# EAGLE design TUR8535 (EAGLE 5.01)
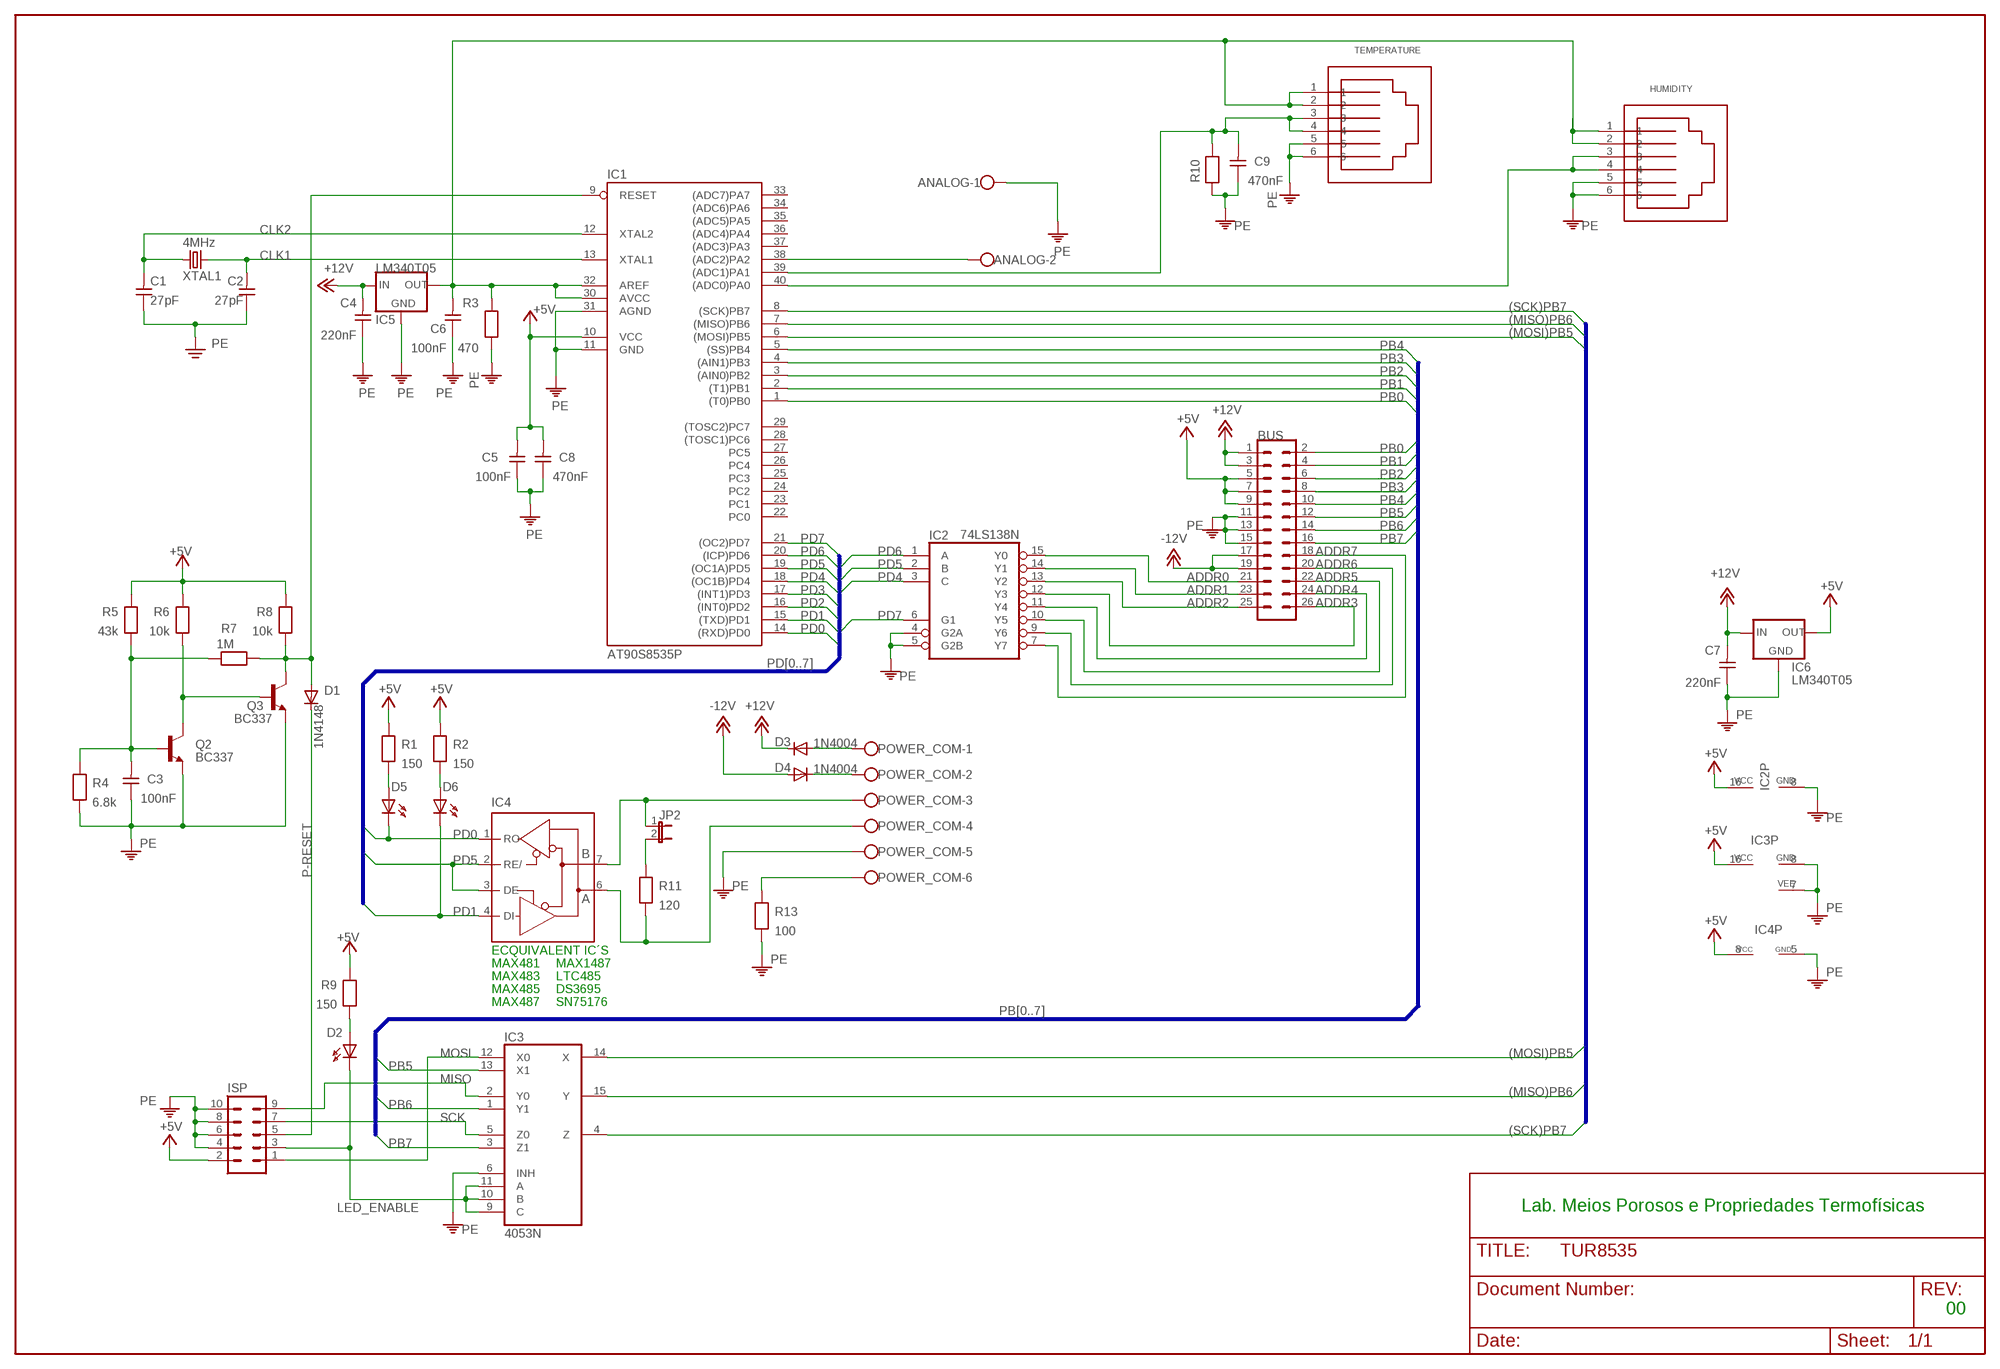
[diagram p0: schematic, sheet 1]

## Parts
ANALOG  AK500/2  [AK500/2]
BUS  ML26  [ML26]
C1  27pF  CAPNP-5  [C-5]
C2  27pF  CAPNP-5  [C-5]
C3  100nF  CAPNP-5  [C-5]
C4  220nF  CAPNP-5  [C-5]
C5  100nF  CAPNP-5  [C-5]
C6  100nF  CAPNP-5  [C-5]
C7  220nF  CAPNP-5  [C-5]
C8  470nF  CAPNP-5  [C-5]
C9  470nF  CAPNP-5  [C-5]
D1  1N4148  [DO35-10]
D2  LED5MM  [LED5MM]
D3  1N4004  [DO41-10]
D4  1N4004  [DO41-10]
D5  LED3MM  [LED3MM]
D6  LED3MM  [LED3MM]
HUMIDITY  RJ11V  [RJ11V]
IC1  AT90S8535P  [DIL40]
IC2  74LS138N  [DIL16]
IC3  4053N  [DIL16]
IC4  MAX481CPA  [DIL08]
IC5  LM340T05  78XXL  [78XXL]
IC6  LM340T05  78XXL  [78XXL]
ISP  ML10  [ML10]
JP2  JP1E  [JP1]
POWER_COM  AK500/6  [AK500/6]
Q2  BC337  [TO92]
Q3  BC337  [TO92]
R1  150  RESEU-10  [R-10]
R2  150  RESEU-10  [R-10]
R3  470  RESEU-10  [R-10]
R4  6.8k  RESEU-10  [R-10]
R5  43k  RESEU-10  [R-10]
R6  10k  RESEU-10  [R-10]
R7  1M  RESEU-10  [R-10]
R8  10k  RESEU-10  [R-10]
R9  150  RESEU-10  [R-10]
R10  RESEU-10  [R-10]
R11  120  RESEU-10  [R-10]
R13  100  RESEU-10  [R-10]
TEMPERATURE  RJ11V  [RJ11V]
XTAL1  4MHz  CRYTALHC18U-V  [HC18U-V]

## Nets
(MISO)PB6: IC1.7((MISO)PB6) IC3.15(Y)
(MOSI)PB5: IC1.6((MOSI)PB5) IC3.14(X)
(SCK)PB7: IC1.8((SCK)PB7) IC3.4(Z)
+5V: BUS.5 BUS.7 BUS.9 C5.2 C8.2 IC1.10(VCC) IC2.16(VCC) IC3.16(VCC) IC4.8(VCC) IC6.OUT ISP.2 R1.2 R2.2 R5.2 R6.2 R8.2 R9.2
+12V: BUS.1 BUS.3 C4.2 C7.2 D3.C IC5.IN IC6.IN
-12V: BUS.17 BUS.19 D4.A
A: IC4.6(A) POWER_COM.4 R11.1
ADC0: HUMIDITY.3 HUMIDITY.4 IC1.40((ADC0)PA0)
ADC1: C9.2 IC1.39((ADC1)PA1) R10.2 TEMPERATURE.3 TEMPERATURE.4
ADC2: ANALOG.2 IC1.38((ADC2)PA2)
ADDR0: BUS.21 IC2.15(Y0)
ADDR1: BUS.23 IC2.14(Y1)
ADDR2: BUS.25 IC2.13(Y2)
ADDR3: BUS.26 IC2.12(Y3)
ADDR4: BUS.24 IC2.11(Y4)
ADDR5: BUS.22 IC2.10(Y5)
ADDR6: BUS.20 IC2.9(Y6)
ADDR7: BUS.18 IC2.7(Y7)
AREF: C6.2 HUMIDITY.1 HUMIDITY.2 IC1.30(AVCC) IC1.32(AREF) IC5.OUT R3.2 TEMPERATURE.1 TEMPERATURE.2
B: IC4.7(B) JP2.1 POWER_COM.3
CLK1: C2.2 IC1.13(XTAL1) XTAL1.2
CLK2: C1.2 IC1.12(XTAL2) XTAL1.1
LED_ENABLE: D2.K(C) IC3.9(C) IC3.10(B) IC3.11(A) ISP.3
MISO: IC3.2(Y0) ISP.9
MOSI: IC3.12(X0) ISP.1
N$7: Q2.3(C) Q3.2(B) R6.1
N$9: C3.2 Q2.2(B) R4.2 R5.1 R7.1
N$11: JP2.2 R11.2
N$14: D3.A POWER_COM.1
N$15: D4.C POWER_COM.2
N$19: D2.A R9.1
N$20: D5.A R1.1
N$21: D6.A R2.1
P-RESET: D1.C ISP.5
PB0: BUS.2 IC1.1((T0)PB0)
PB1: BUS.4 IC1.2((T1)PB1)
PB2: BUS.6 IC1.3((AIN0)PB2)
PB3: BUS.8 IC1.4((AIN1)PB3)
PB4: BUS.10 IC1.5((SS)PB4)
PB5: BUS.12 IC3.13(X1)
PB6: BUS.14 IC3.1(Y1)
PB7: BUS.16 IC3.3(Z1)
PD0: D5.K(C) IC1.14((RXD)PD0) IC4.1(RO)
PD1: D6.K(C) IC1.15((TXD)PD1) IC4.4(DI)
PD2: IC1.16((INT0)PD2)
PD3: IC1.17((INT1)PD3)
PD4: IC1.18((OC1B)PD4) IC2.3(C)
PD5: IC1.19((OC1A)PD5) IC2.2(B) IC4.2(RE/) IC4.3(DE)
PD6: IC1.20((ICP)PD6) IC2.1(A)
PD7: IC1.21((OC2)PD7) IC2.6(G1)
PE: ANALOG.1 BUS.11 BUS.13 BUS.15 C1.1 C2.1 C3.1 C4.1 C5.1 C6.1 C7.1 C8.1 C9.1 HUMIDITY.5 HUMIDITY.6 IC1.11(GND) IC1.31(AGND) IC2.4(G2A) IC2.5(G2B) IC2.8(GND) IC3.6(INH) IC3.7(VEE) IC3.8(GND) IC4.5(GND) IC5.GND IC6.GND ISP.4 ISP.6 ISP.8 ISP.10 POWER_COM.5 Q2.1(E) Q3.1(E) R3.1 R4.1 R10.1 R13.1 TEMPERATURE.5 TEMPERATURE.6
RST: D1.A IC1.9(RESET) Q3.3(C) R7.2 R8.1
RTN: POWER_COM.6 R13.2
SCK: IC3.5(Z0) ISP.7
Unconnected: IC1.22(PC0) IC1.23(PC1) IC1.24(PC2) IC1.25(PC3) IC1.26(PC4) IC1.27(PC5) IC1.28((TOSC1)PC6) IC1.29((TOSC2)PC7) IC1.33((ADC7)PA7) IC1.34((ADC6)PA6) IC1.35((ADC5)PA5) IC1.36((ADC4)PA4) IC1.37((ADC3)PA3)

## Buses
PB[0..7]
(SCK)PB7,(MISO)PB6,(MOSI)PB5
PD[0..7]

## Notes on the sheet
- ECQUIVALENT IC´S
- MAX481 | MAX1487
- MAX483 | LTC485
- MAX485 | DS3695
- MAX487 | SN75176
- Lab. Meios Porosos e Propriedades Termofísicas
- 00

## Library data of the parts
ANALOG = con-ptr500:AK500/2: CONNECTOR
BUS = con-harting-ml:ML26: HARTING
C1-C9 = discrete:CAPNP-5
D1 = diode:1N4148: DIODE high speed (Philips)
D2 D5 D6 = led:LED: LED
D3 D4 = diode:1N4004: DIODE general purpose rectifier, 1 A
HUMIDITY TEMPERATURE = con-rj:RJ11V: 6 pins RJ-11 connector
IC1 = atmel:AT90*8535P: MICROCONTROLLER 8 Kbytes FLASH 512 bytes SRAM 512 bytes EEPROM UART 8-channel 10 bit ADC
IC2 = 74xx-eu:74*138: 3-line to 8-line DECODER/DEMULTIPLEXER
IC3 = 40xx:4053: Triple 2-channel ANALOG MULTIPLEXER
IC4 = maxim:MAX481CPA: RS485 TRANSEIVER
IC5 IC6 = v-reg:78XXL: VOLTAGE REGULATOR
ISP = con-harting-ml:ML10: HARTING
JP2 = jumper:JP1E: JUMPER
POWER_COM = con-ptr500:AK500/6: CONNECTOR
Q2 Q3 = transistor-npn:BC337*: NPN Transistor
R1-R11 R13 = discrete:RESEU-10
XTAL1 = crystal:CRYTAL: CRYSTAL

## Board
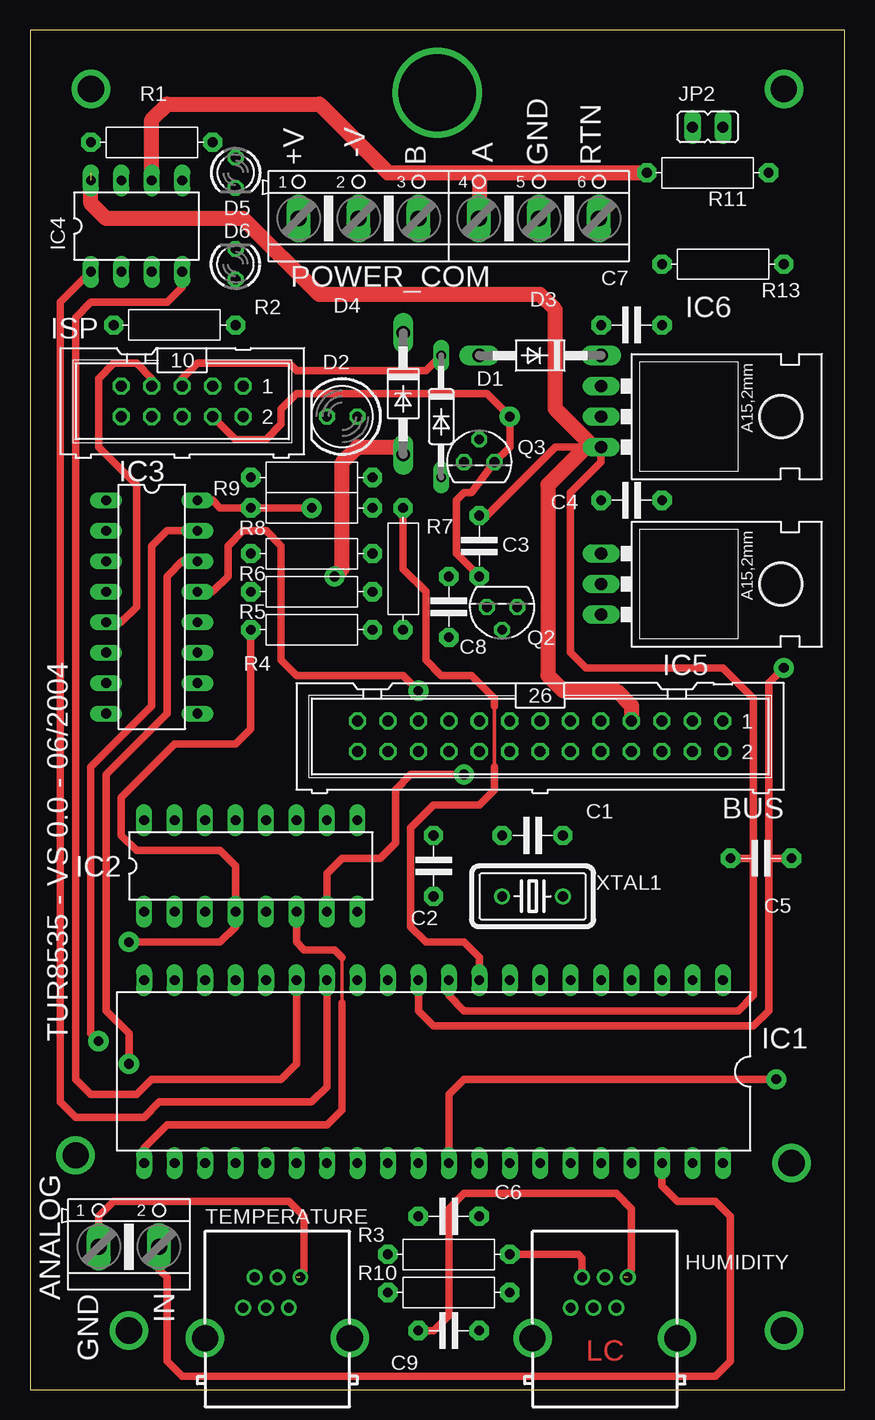
[diagram p1: board, top side]
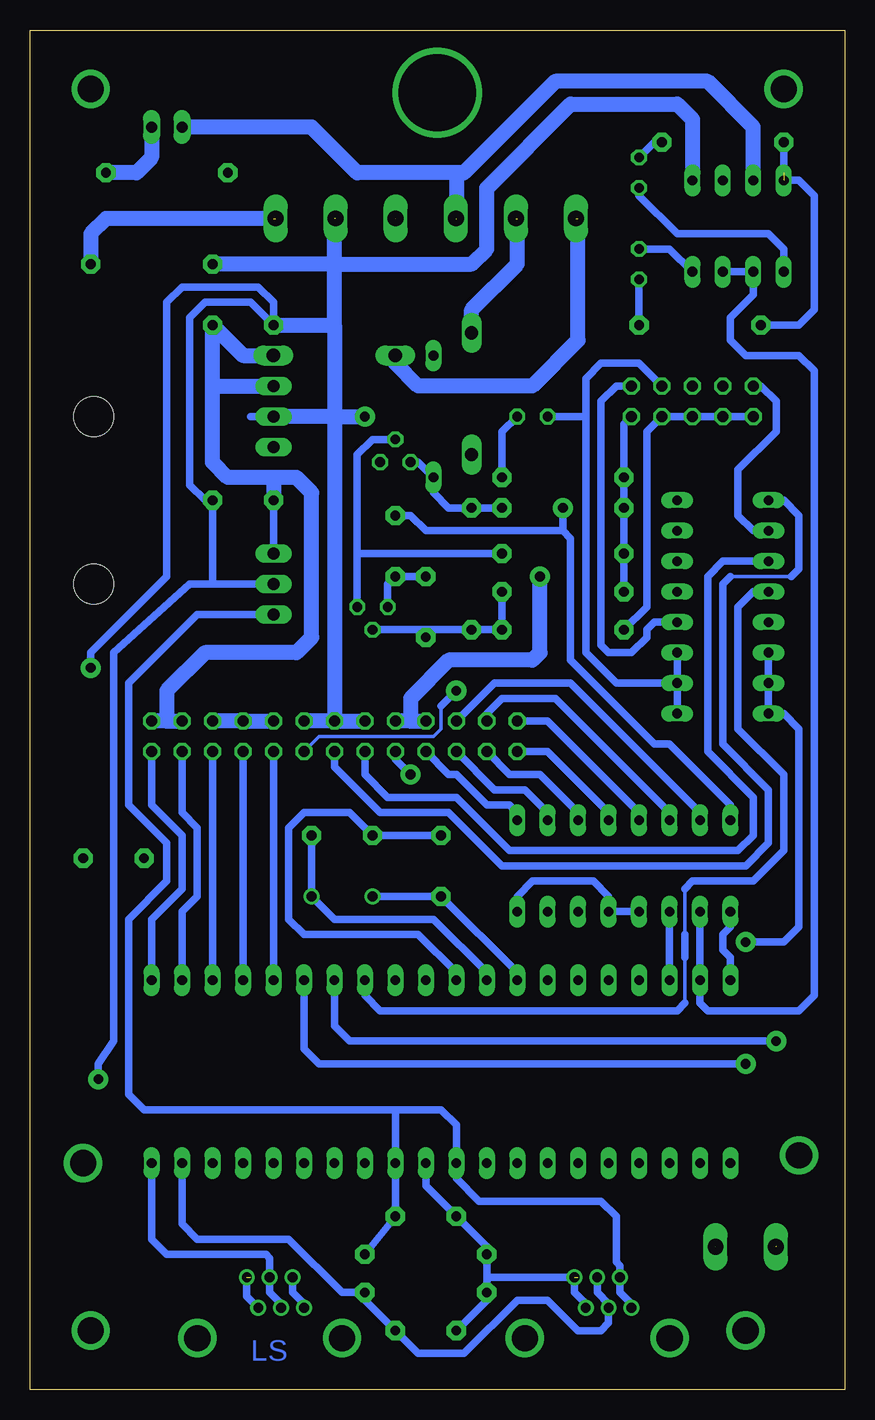
[diagram p2: board, bottom side, seen from below]

Size 67.92 x 113.33 mm. Coordinates in mm from the lower left corner, seen from the top.
Outline: 0,0 67.92,0 67.92,113.33 0,113.33 0,0
Copper layers (1*16): Top 0.035mm / dielectric 1.5mm / Bottom 0.035mm
Design rules "terminal": minimum track width 16mil, minimum drill 24mil, track to track 12mil, track to pad 12mil, pad to pad 12mil, via to via 12mil, smd to smd 0mil, copper to edge 40mil, drill to drill 12mil, minimum pad ring 10mil, minimum via ring 8mil, stop-mask expansion 4mil, vias tented up to drill 0mil, thermal gap 10mil

### Footprints (pad centres in the part's own frame; a part is rotated, then mirrored left to right if it is on the bottom)
AK500/2 = drill 1.321 long: 1 -2.515,0; 2 2.515,0
ML26 = drill 0.914 octagon: 1 -15.24,-1.27; 2 -15.24,1.27; 3 -12.7,-1.27; 4 -12.7,1.27; 5 -10.16,-1.27; 6 -10.16,1.27; 7 -7.62,-1.27; 8 -7.62,1.27; 9 -5.08,-1.27; 10 -5.08,1.27; 11 -2.54,-1.27; 12 -2.54,1.27; 13 0,-1.27; 14 0,1.27; 15 2.54,-1.27; 16 2.54,1.27; 17 5.08,-1.27; 18 5.08,1.27; 19 7.62,-1.27; 20 7.62,1.27; 21 10.16,-1.27; 22 10.16,1.27; 23 12.7,-1.27; 24 12.7,1.27; 25 15.24,-1.27; 26 15.24,1.27
C-5 = drill 0.813 pad 1.6 octagon: 1 -2.54,0; 2 2.54,0
DO35-10 = drill 0.813 long: A 5.08,0; C -5.08,0
LED5MM = drill 0.813 octagon: A -1.27,0; K 1.27,0
DO41-10 = drill 1.118 long: A 5.08,0; C -5.08,0
LED3MM = drill 0.813 octagon: A -1.27,0; K 1.27,0
RJ11V = drill 0.813 pad 1.27 round: 1 -5.08,0.635; 2 -2.54,-0.318; 3 -5.08,-1.27; 4 -2.54,-2.223; 5 -5.08,-3.175; 6 -2.54,-4.128 | drill 2.184 pad 2.54 round: P$1 -7.62,3.81; P$3 -7.62,-8.255
DIL40 = drill 0.813 long: 1 -24.13,-7.62; 2 -21.59,-7.62; 3 -19.05,-7.62; 4 -16.51,-7.62; 5 -13.97,-7.62; 6 -11.43,-7.62; 7 -8.89,-7.62; 8 -6.35,-7.62; 9 -3.81,-7.62; 10 -1.27,-7.62; 11 1.27,-7.62; 12 3.81,-7.62; 13 6.35,-7.62; 14 8.89,-7.62; 15 11.43,-7.62; 16 13.97,-7.62; 17 16.51,-7.62; 18 19.05,-7.62; 19 21.59,-7.62; 20 24.13,-7.62; 21 24.13,7.62; 22 21.59,7.62; 23 19.05,7.62; 24 16.51,7.62; 25 13.97,7.62; 26 11.43,7.62; 27 8.89,7.62; 28 6.35,7.62; 29 3.81,7.62; 30 1.27,7.62; 31 -1.27,7.62; 32 -3.81,7.62; 33 -6.35,7.62; 34 -8.89,7.62; 35 -11.43,7.62; 36 -13.97,7.62; 37 -16.51,7.62; 38 -19.05,7.62; 39 -21.59,7.62; 40 -24.13,7.62
DIL16 = drill 0.813 long: 1 -8.89,-3.81; 2 -6.35,-3.81; 3 -3.81,-3.81; 4 -1.27,-3.81; 5 1.27,-3.81; 6 3.81,-3.81; 7 6.35,-3.81; 8 8.89,-3.81; 9 8.89,3.81; 10 6.35,3.81; 11 3.81,3.81; 12 1.27,3.81; 13 -1.27,3.81; 14 -3.81,3.81; 15 -6.35,3.81; 16 -8.89,3.81
DIL08 = drill 0.813 long: 1 -3.81,-3.81; 2 -1.27,-3.81; 3 1.27,-3.81; 4 3.81,-3.81; 5 3.81,3.81; 6 1.27,3.81; 7 -1.27,3.81; 8 -3.81,3.81
78XXL = drill 1.016 long: GND 0,-3.81; IN -2.54,-3.81; OUT 2.54,-3.81 | hole 3.302: 0,11.176
ML10 = drill 0.914 octagon: 1 -5.08,-1.27; 2 -5.08,1.27; 3 -2.54,-1.27; 4 -2.54,1.27; 5 0,-1.27; 6 0,1.27; 7 2.54,-1.27; 8 2.54,1.27; 9 5.08,-1.27; 10 5.08,1.27
JP1 = drill 0.914 long: 1 0,-1.27; 2 0,1.27
AK500/6 = drill 1.321 long: 1 -12.522,0; 2 -7.518,0; 3 -2.515,0; 4 2.515,0; 5 7.518,0; 6 12.522,0
TO92 = drill 0.813 octagon: 1 1.27,0; 2 0,1.905; 3 -1.27,0
R-10 = drill 0.813 pad 1.6 octagon: 1 -5.08,0; 2 5.08,0
HC18U-V = drill 0.813 round: 1 -2.54,0; 2 2.54,0

### Placement (x,y rotation side)
ANALOG  8.25,11.9 0 top
BUS  42.54,54.45 180 top
C1  41.91,46.19 0 top
C2  33.65,43.65 270 top
C3  34.92,65.24 270 top
C4  50.16,74.13 180 top
C5  60.95,44.28 180 top
C6  34.92,14.44 0 top
C7  50.16,88.73 0 top
C8  37.46,70.32 90 top
C9  34.92,4.91 0 top
D1  34.28,81.11 270 top
D2  26.03,81.11 180 top
D3  42.54,86.19 180 top
D4  31.11,83.02 270 top
D5  17.14,101.44 270 top
D6  17.14,93.81 90 top
HUMIDITY  45.71,11.9 90 top
IC1  33.65,26.5 180 top
IC2  18.41,43.65 0 top
IC3  10.15,65.24 270 top
IC4  8.88,96.99 0 top
IC5  51.43,67.14 270 top
IC6  51.43,81.11 270 top
ISP  12.7,82.39 180 top
JP2  56.51,105.25 270 top
POWER_COM  34.92,97.62 0 top
Q2  39.37,65.24 180 top
Q3  37.46,77.3 0 top
R1  10.15,103.97 180 top
R2  12.06,88.73 180 top
R3  34.92,11.26 0 top
R4  23.49,63.34 0 top
R5  23.49,66.51 180 top
R6  23.49,69.69 180 top
R7  31.11,68.41 90 top
R8  23.49,73.5 180 top
R9  23.49,76.03 180 top
R10  34.92,8.09 0 top
R11  56.51,101.44 0 top
R13  57.78,93.81 0 top
TEMPERATURE  18.41,11.9 90 top
XTAL1  41.91,41.11 180 top

### Tracks (layer width: path | path; a pad name or v marks a point on that pad's centre or on a via)
(MISO)PB6  (via drill 0.81 pad 1.68)
  Top 0.61: v5.71,29.04 5.08,29.68 5.08,51.91 10.15,56.98 10.15,70.32 11.42,71.59 IC3.15
  Bottom 0.61: IC1.7 42.54,30.31 41.27,29.04 v5.71,29.04
(MOSI)PB5  (via drill 0.81 pad 1.68)
  Top 0.61: v8.25,27.14 8.25,29.68 6.35,31.59 6.35,51.27 11.42,56.35 11.42,67.78 12.7,69.05 IC3.14
  Bottom 0.61: IC1.6 45.08,28.41 43.81,27.14 v8.25,27.14
(SCK)PB7
  Bottom 0.305: 13.33,37.94 13.33,41.74 | 13.33,32.22 13.33,36.03
  Bottom 0.61: IC1.8 40,32.86 38.73,31.59 13.96,31.59 13.33,32.22 | 13.33,41.74 12.7,42.38 7.62,42.38 5.08,44.92 5.08,51.27 8.88,55.08 8.88,65.24 7.62,66.51 IC3.4 | 13.33,36.03 13.33,37.94
+5V  (via drill 0.81 pad 1.68)  (1 unrouted)
  Top 0.61: IC3.16 15.23,74.13 15.87,73.5 R8.2 v23.49,73.5 | IC1.10 34.92,32.86 36.19,31.59 59.05,31.59 60.32,32.86 60.32,44.28 | 60.32,44.28 60.32,57.62 57.78,60.16 46.35,60.16 45.08,61.43 45.08,74.77 47.62,77.3 IC6.OUT 43.81,78.58 38.09,72.86 C8.2 | 60.32,44.28 C5.2
  Top 1.27: BUS.7 50.16,56.98 48.89,58.26 44.45,58.26 43.17,59.52 43.17,75.4 46.35,78.58 IC6.OUT 46.98,78.58 43.81,81.75 43.81,90 42.54,91.28 24.12,91.28 17.77,97.62 6.35,97.62 5.08,98.89 IC4.8
  Bottom 0.61: R5.2 R6.2 R8.2 R9.2 18.41,80.48 ISP.2 | IC2.16 9.52,48.73 14.6,53.81 15.87,53.81 22.86,60.8 22.86,70.95 23.49,71.59 | 23.49,71.59 34.92,71.59 36.19,72.86 C8.2 | 23.49,71.59 v23.49,73.5 | R2.2 3.81,88.73 2.53,90 2.53,99.53 3.81,100.8 IC4.8 | 5.08,101.44 R1.2
  Bottom 1.27: BUS.9 BUS.7 BUS.5
+12V
  Bottom 0.61: C4.2 IC5.IN
  Bottom 1.27: 56.51,55.71 BUS.3 | 56.51,55.71 BUS.1 | 52.7,83.66 52.7,77.3 51.43,76.03 47.62,76.03 | 52.7,83.66 C7.2 50.16,86.19 D3.C | 47.62,76.03 C4.2 | 52.7,83.66 IC6.IN | 56.51,55.71 56.51,58.26 53.34,61.43 45.71,61.43 44.45,62.7 44.45,74.77 45.71,76.03 47.62,76.03
-12V  (via drill 0.81 pad 1.68)
  Top 1.27: v25.39,67.78 26.03,68.41 26.03,77.3 27.3,78.58 30.47,78.58 D4.A
  Bottom 1.27: 36.19,55.71 BUS.19 | 36.19,55.71 BUS.17 | 36.19,55.71 36.19,57.62 33.02,60.8 26.03,60.8 25.39,61.43 v25.39,67.78
A  (1 unrouted)
  Top 1.27: IC4.6 10.15,105.88 11.42,107.15 24.12,107.15 29.84,101.44 37.46,101.44 | 37.46,101.44 37.46,97.62 | 37.46,101.44 R11.1
ADC0
  Bottom 0.61: HUMIDITY.3 46.98,7.14 47.94,8.09 HUMIDITY.4 47.94,10.95 48.26,11.26 56.51,11.26 57.78,12.54 IC1.40
ADC1
  Bottom 0.61: TEMPERATURE.4 20.63,8.09 19.68,7.14 TEMPERATURE.3 19.68,5.55 20.31,4.91 22.22,4.91 24.76,7.45 27.3,7.45 31.74,3.01 35.55,3.01 C9.2 40,7.45 R10.2 41.91,8.09 46.35,12.54 53.97,12.54 55.24,13.8 IC1.39
ADC2  (1 unrouted)
  Top 0.61: IC1.38 52.7,16.98 53.97,15.71 57.14,15.71 58.41,14.44 58.41,2.37 57.14,1.1 12.7,1.1 11.42,2.37 11.42,9.36 10.79,9.99 10.79,11.9
ADDR0
  Bottom 0.61: IC2.15 12.06,48.09 22.86,58.89 29.2,58.89 BUS.21
ADDR1
  Bottom 0.61: IC2.14 14.6,48.09 24.12,57.62 28.57,57.62 29.84,56.35 BUS.23
ADDR2
  Bottom 0.61: IC2.13 17.14,48.09 24.76,55.71 BUS.25
ADDR3
  Bottom 0.61: IC2.12 19.68,48.09 24.76,53.17 BUS.26
ADDR4
  Bottom 0.61: IC2.11 22.22,48.09 25.39,51.27 27.93,51.27 BUS.24
ADDR5
  Bottom 0.61: IC2.10 24.76,48.09 26.66,50 29.2,50 BUS.22
ADDR6
  Bottom 0.61: IC2.9 27.3,48.09 27.93,48.73 29.84,48.73 32.38,51.27 33.02,51.27 BUS.20
ADDR7  (via drill 0.81 pad 1.68)
  Top 0.61: IC2.7 24.76,43.02 26.03,44.28 29.2,44.28 30.47,45.55 30.47,50 31.74,51.27 v36.19,51.27
  Bottom 0.61: v36.19,51.27 37.46,52.54 BUS.18
AREF
  Top 0.61: HUMIDITY.2 46.03,10.95 45.71,11.26 R3.2
  Bottom 0.61: IC5.OUT 53.97,64.6 59.69,58.89 59.69,48.73 56.51,45.55 56.51,42.38 59.69,39.2 59.69,24.6 58.41,23.33 37.46,23.33 | 37.46,23.33 33.65,23.33 32.38,22.06 IC1.30 32.38,17.62 30.47,15.71 20.31,15.71 19.04,14.44 19.04,10.63 18.73,10.31 TEMPERATURE.2 18.73,8.09 17.77,7.14 TEMPERATURE.1 | 37.46,23.33 IC1.32 C6.2 R3.2 | HUMIDITY.1 45.08,7.14 46.03,8.09 HUMIDITY.2
B  (1 unrouted)
  Bottom 1.27: 31.74,101.44 32.38,101.44 32.38,97.62 | 31.74,101.44 40.63,101.44 44.45,105.25 JP2.1 | 31.74,101.44 24.12,109.05 11.42,109.05 7.62,105.25 IC4.7
CLK1
  Bottom 0.61: XTAL1.2 C2.2 27.3,34.76 IC1.13
CLK2
  Bottom 0.61: C1.2 XTAL1.1 42.54,39.2 34.28,39.2 29.84,34.76 IC1.12
LED_ENABLE
  Bottom 0.61: IC3.9 IC3.10 | IC3.10 IC3.11 | IC3.10 19.04,58.89 21.59,61.43 21.59,81.11 | 21.59,81.11 21.59,84.29 20.31,85.56 17.14,85.56 ISP.3 | 21.59,81.11 D2.K
MISO
  Bottom 0.61: IC3.2 7.62,71.59 8.88,72.86 8.88,76.67 5.71,79.84 5.71,82.39 6.98,83.66 ISP.9
MOSI
  Bottom 0.61: ISP.1 19.04,83.66 20.31,82.39 20.31,62.06 19.68,61.43 17.77,61.43 16.5,62.7 16.5,63.34 15.87,63.97 IC3.12
N$1  (via drill 2.18 pad 2.54)
  other vias: 62.86,108.42
N$3  (via drill 6.45)
  other vias: 33.97,108.1
N$4  (via drill 2.18 pad 2.54)
  other vias: 63.5,18.88
N$5  (via drill 2.18)
  other vias: 5.08,108.42
N$6  (via drill 2.18 pad 2.54)
  other vias: 8.25,4.91
N$7
  Bottom 0.61: 40.63,69.69 Q2.3 | R6.1 40.63,69.69 | Q3.2 39.37,79.21 40.63,77.94 40.63,69.69
N$8  (via drill 2.18 pad 2.54)
  other vias: 62.86,4.91
N$9
  Bottom 0.61: 34.92,63.34 R7.1 R4.2 R5.1 | 34.92,63.34 C3.2 | 34.92,63.34 Q2.2
N$11
  Bottom 1.27: JP2.2 57.78,102.7 59.05,101.44 R11.2
N$12  (via drill 2.18 pad 2.54)
  other vias: 3.81,19.52
N$14  (1 unrouted)
  Bottom 1.27: D3.A 37.46,85.56 35.55,83.66 26.03,83.66 22.22,87.47 22.22,97.62
N$15  (1 unrouted)
  Bottom 1.27: D4.C 31.11,90 27.3,93.81 27.3,97.62
N$19
  Bottom 0.61: R9.1 28.57,79.84 D2.A
N$20
  Bottom 0.61: D5.A 15.87,103.97 R1.1
N$21
  Bottom 0.61: R2.1 D6.A
P-RESET
  Top 0.61: D1.C 33.02,84.92 22.22,84.92 21.59,85.56 13.96,85.56 12.7,84.29 ISP.5
PB0
  Bottom 0.61: IC1.1 57.78,39.2 55.24,41.74 55.24,46.19 57.78,48.73 BUS.2
PB1
  Bottom 0.61: IC1.2 55.24,39.84 53.97,41.11 53.97,46.83 55.24,48.09 BUS.4
PB2
  Bottom 0.61: IC1.3 BUS.6
PB3
  Bottom 0.61: IC1.4 BUS.8
PB4
  Bottom 0.61: IC1.5 BUS.10
PB5  (via drill 0.81 pad 1.68)
  Top 0.61: v32.38,58.26 31.11,59.52 22.22,59.52 20.95,60.8 20.95,70.32 19.68,71.59 17.77,71.59 16.5,70.32 16.5,67.78 15.23,66.51 IC3.13
  Bottom 0.305: BUS.12 43.81,54.45 34.28,54.45 33.65,55.08 33.65,56.98
  Bottom 0.61: v32.38,58.26 33.65,56.98
PB6
  Bottom 0.305: 9.52,67.78 4.44,67.78
  Bottom 0.61: BUS.14 42.54,51.91 38.73,48.09 33.02,48.09 28.57,43.65 8.25,43.65 6.35,45.55 6.35,50 10.15,53.81 10.15,67.14 9.52,67.78 | IC3.1 5.08,74.13 3.81,72.86 3.81,68.41 4.44,67.78
PB7
  Bottom 0.61: BUS.16 40,51.27 38.09,49.37 32.38,49.37 27.93,44.92 8.88,44.92 7.62,46.19 7.62,49.37 11.42,53.17 11.42,67.78 10.15,69.05 IC3.3
PD0
  Top 0.61: IC1.14 24.76,25.23 23.49,23.96 10.79,23.96 9.52,22.7 3.81,22.7 2.53,23.96 2.53,90.64 IC4.1
  Bottom 0.61: IC4.1 5.08,95.08 6.35,96.36 13.96,96.36 17.14,99.53 D5.K
PD1
  Top 0.61: IC1.15 22.22,27.14 20.95,25.87 10.15,25.87 8.88,24.6 5.08,24.6 3.81,25.87 3.81,89.37 5.08,90.64 11.42,90.64 12.7,91.91 IC4.4
  Bottom 0.61: IC4.4 14.6,95.08 D6.K
PD4
  Bottom 0.61: IC1.18 IC2.3
PD5
  Bottom 0.61: IC2.2 IC1.19 12.06,32.22 11.42,31.59 3.81,31.59 2.53,32.86 2.53,84.92 3.81,86.19 8.25,86.19 9.52,87.47 9.52,89.37 7.62,91.28 IC4.2 IC4.3
PD6
  Bottom 0.61: IC1.20 9.52,36.03 10.15,36.66 10.15,37.94 9.52,38.57 IC2.1
PD7
  Top 0.305: 26.03,32.22 26.03,36.03
  Top 0.61: IC1.21 9.52,20.16 11.42,22.06 24.76,22.06 26.03,23.33 26.03,32.22 | 26.03,36.03 25.39,36.66 22.86,36.66 22.22,37.3 IC2.6
PE  (via drill 0.81 pad 1.68)  (4 unrouted)
  Top 0.61: C8.1 35.55,69.69 35.55,74.13 36.19,74.77 36.83,74.77 Q3.1 40,78.58 v40,81.11 38.09,83.02 22.22,83.02 20.95,81.75 20.95,80.48 19.68,79.21 17.14,79.21 ISP.4 | IC1.11 32.38,31.59 33.65,30.31 60.32,30.31 61.59,31.59 61.59,44.28 | 61.59,44.28 61.59,58.89 v62.86,60.16 | R4.1 18.41,55.08 17.14,53.81 12.06,53.81 7.62,49.37 7.62,46.19 8.88,44.92 15.87,44.92 17.14,43.65 IC2.4 17.14,38.57 15.87,37.3 v8.25,37.3 | C9.1 33.65,4.91 34.92,6.18 34.92,15.07 36.19,16.34 48.89,16.34 50.16,15.07 50.16,9.99 49.52,9.36 | 5.71,11.9 5.71,14.44 6.98,15.71 21.59,15.71 22.86,14.44 22.86,9.99 22.22,9.36 | v62.23,25.87 36.19,25.87 34.92,24.6 IC1.31 | 61.59,44.28 C5.1
  Bottom 0.61: C2.1 C1.1 41.27,48.09 45.08,48.09 46.35,46.83 46.35,39.2 45.08,37.94 35.55,37.94 32.38,34.76 IC1.11 | IC2.8 27.3,41.11 26.03,42.38 20.95,42.38 19.68,41.11 IC2.5 IC2.4 | IC3.6 IC3.7 IC3.8 5.08,56.35 3.81,55.08 3.81,38.57 5.08,37.3 v8.25,37.3 | R4.1 16.5,65.24 16.5,79.84 ISP.4 ISP.6 ISP.8 ISP.10 | 52.7,67.14 54.6,67.14 60.95,61.43 60.95,29.04 62.23,27.14 v62.23,25.87 | 52.7,67.14 IC5.GND | IC6.GND 49.52,81.11 | 52.7,67.14 C4.1 53.34,74.13 54.6,75.4 54.6,89.37 53.34,90.64 49.52,90.64 C7.1 47.62,90.64 48.89,91.91 55.24,91.91 56.51,90.64 56.51,67.78 62.86,61.43 v62.86,60.16 | IC1.31 34.92,16.98 C6.1 29.84,11.9 R3.1 29.84,9.36 | HUMIDITY.5 49.84,7.77 HUMIDITY.6 | TEMPERATURE.5 21.59,7.14 22.54,8.09 TEMPERATURE.6 29.84,9.36 | 29.84,9.36 R10.1 29.84,7.45 C9.1 | C3.1 C8.1 38.09,67.14 Q2.1
  Bottom 1.27: BUS.13 BUS.11 | BUS.13 BUS.15 | 42.54,81.11 BUS.13 | 42.54,81.11 IC6.GND | 42.54,88.73 42.54,81.11 | C7.1 42.54,88.73 | 42.54,88.73 42.54,93.81 | 42.54,93.81 42.54,97.62 | 42.54,93.81 R13.1 | IC4.5 12.7,105.88 13.96,107.15 22.86,107.15 29.84,100.17 29.84,95.08 31.11,93.81 42.54,93.81 | 42.54,81.11 v40,81.11
RST
  Top 0.305: 38.73,51.91 38.73,56.98
  Top 0.61: IC1.9 37.46,36.03 36.19,37.3 33.02,37.3 31.74,38.57 31.74,46.83 33.65,48.73 37.46,48.73 38.73,50 38.73,51.91 | 38.73,56.98 38.73,57.62 36.83,59.52 34.28,59.52 33.02,60.8 33.02,66.51 31.11,68.41 R7.2
  Bottom 0.61: R8.1 R7.2 33.02,73.5 34.28,74.77 D1.A 35.55,77.3 Q3.3
RTN  (1 unrouted)
  Bottom 1.27: R13.2 62.86,96.36 61.59,97.62 47.62,97.62
SCK
  Top 0.61: ISP.7 10.15,84.29 8.88,85.56 6.98,85.56 5.71,84.29 5.71,78.58 8.88,75.4 8.88,65.24 7.62,63.97 IC3.5

### Text on the board
Top: LC
Bottom: LS
tPlace: A | +V | -V | B | GND | RTN | TUR8535 - VS 0.0 - 06/2004 | IN | GND